# Altium schematic sheet CANbus.SchDoc
size A
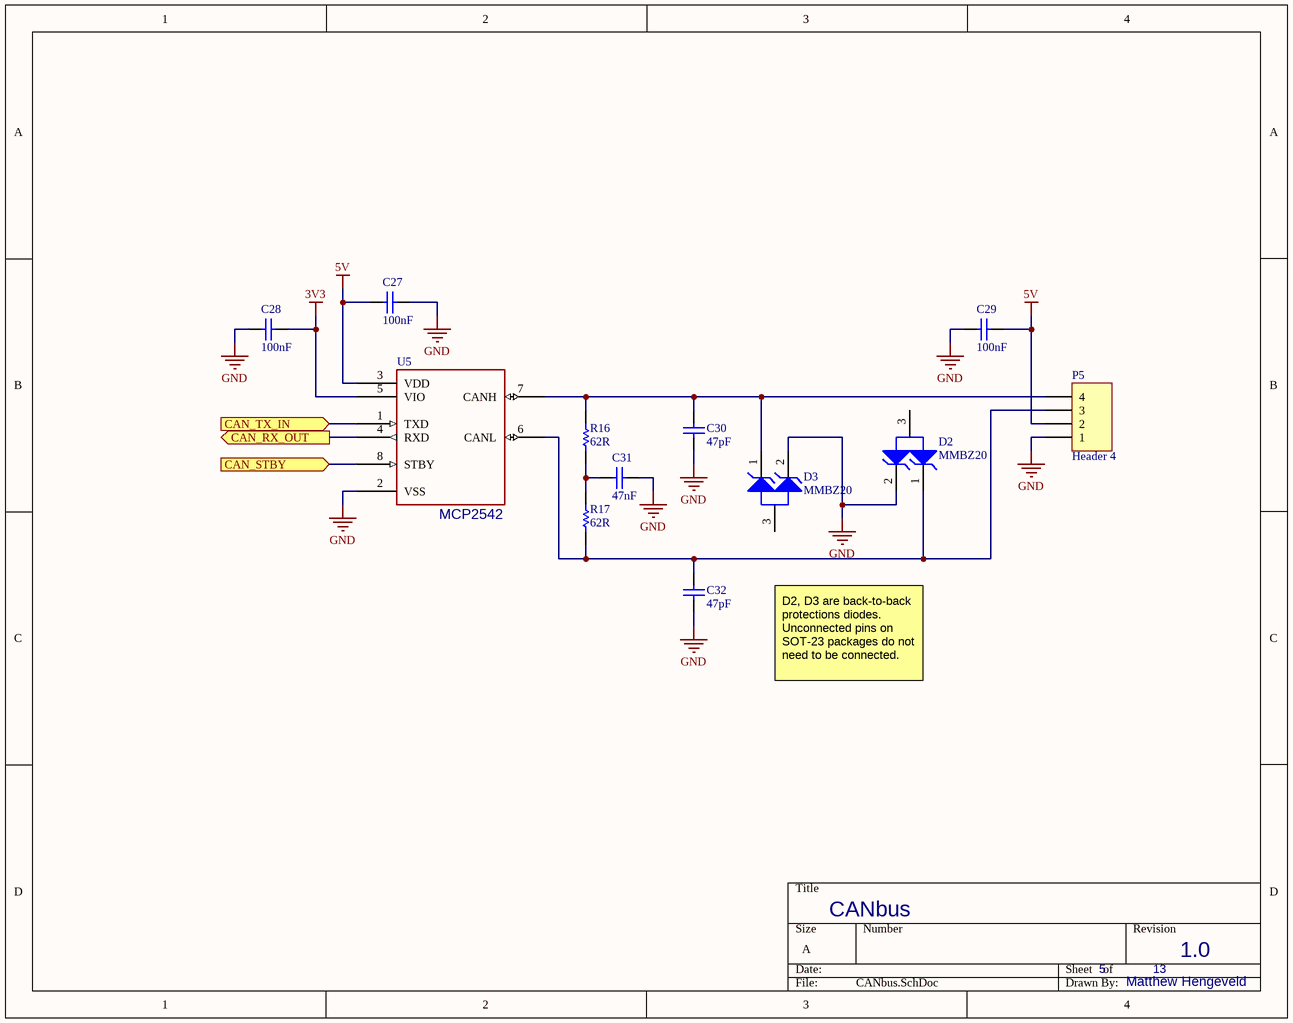
[diagram p0: CANbus.SchDoc]

## Parts
C27  100nF  [CAPC1608X92X38LL15T08]
C28  100nF  [CAPC1608X92X38LL15T08]
C29  100nF  [CAPC1608X92X38LL15T08]
C30  47pF  [CAPC1608X87X35LL15T15]
C31  47nF  [CAPC2013X88X50LL20T25]
C32  47pF  [CAPC1608X87X35LL15T15]
D2  MMBZ20  [SOT-23-3]
D3  MMBZ20  [SOT-23-3]
P5  Header 4  [HDR1X4]
R16  62R  [RESC3216X70X50LL05T20]
R17  62R  [RESC3216X70X50LL05T20]
U5  MCP2542  [MCHP-SOIC-SN8_N]  (value not drawn)

## Ports
CAN_RX_OUT (out), CAN_STBY (in), CAN_TX_IN (in)

## Nets
3V3: C28.2 U5.5(VIO)
5V: C27.1 C29.2 P5.2 U5.3(VDD)
GND: C27.2 C28.1 C29.1 C30.1 C31.2 C32.1 D2.2(K2) D3.2(K2) P5.1 U5.2(VSS)
CAN_RX_OUT: U5.4(RXD) ; port CAN_RX_OUT
CAN_STBY: U5.8(STBY) ; port CAN_STBY
CAN_TX_IN: U5.1(TXD) ; port CAN_TX_IN
NetC30_2: C30.2 D3.1(K1) P5.4 R16.2 U5.7(CANH)
NetC31_1: C31.1 R16.1 R17.2
NetC32_2: C32.2 D2.1(K1) P5.3 R17.1 U5.6(CANL)

Not connected (* = marked no-connect by the designer): D2 3(A); D3 3(A)

## Notes on the sheet
- D2, D3 are back-to-back protections diodes. Unconnected pins on SOT-23 packages do not need to be connected.
- CANbus
- 5
- 13
- 1.0
- Matthew Hengeveld

## Library data of the parts
C27-C29 = CMP-2006-01974-1: Part Number: VJ0603Y104KNXAO; Manufacturer: Vitramon
C30 C32 = CMP-2006-03321-1: Manufacturer: Kemet; Part Number: C0603C470J1GACTU
C31 = CMP-2007-00392-1: Manufacturer: Kemet; Part Number: C0805C473K3RACTU
D2 D3 = TVS Diode: Transient Voltage Suppressor Diode Array, Dual Common Anode Diodes for ESD Protection, 3-Pin SOT-23, Pb-Free, Tape and Reel; PartNumber: SM12T1G; Manufacturer: On Semiconductor; PPK Max (W): 300; IR Max (uA): 1; Direction: Unidirectional; Mounting Technology: Surface Mount; RoHS: Pb-Free; ComponentLink3URL: http://www.onsemi.cn/pub_link/Collateral/318-08.PDF; ComponentLink2Description: Datasheet; ComponentLink1URL: http://www.onsemi.com/; ComponentLink3Description: Package Specification; PackageReference: SOT-23-3-318-08; ComponentLink2URL: http://www.onsemi.com/pub_link/Collateral/SM12T1-D.PDF; Packing: Tape and Reel; DatasheetVersion: Rev. 6; PackageVersion: Rev. AP, 11/2009; ComponentLink1Description: Manufacturer URL; PackageDescription: 3-Pin Small Outline Transistor, Body 2.92 x 1.3 mm, Pitch 0.95 mm
P5 = Header 4: Header, 4-Pin; LatestRevisionDate: 17-Jul-2002; LatestRevisionNote: Re-released for DXP Platform.; Publisher: Altium Limited
R16 R17 = CMP-2003-00795-1: Part Number: ERJ8CWFR024V; Manufacturer: Panasonic